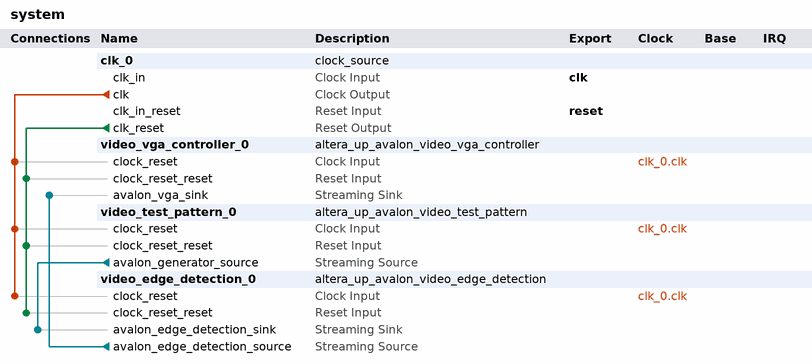
[diagram p0: system contents]
# Platform Designer (Qsys) system system, Cyclone II EP2C35F672C6
# Parameters at their usual value, and those the tool derives, are not listed.
package require -exact qsys 13.0
create_system system
set_project_property DEVICE_FAMILY {Cyclone II}
set_project_property DEVICE EP2C35F672C6

add_instance clk_0 clock_source 13.0
set_instance_parameter_value clk_0 clockFrequency 50000000

add_instance video_vga_controller_0 altera_up_avalon_video_vga_controller 13.0
set_instance_parameter_value video_vga_controller_0 board DE2

add_instance video_test_pattern_0 altera_up_avalon_video_test_pattern 13.0
set_instance_parameter_value video_test_pattern_0 width 720
set_instance_parameter_value video_test_pattern_0 height 720

add_instance video_edge_detection_0 altera_up_avalon_video_edge_detection 13.0
set_instance_parameter_value video_edge_detection_0 width 720
set_instance_parameter_value video_edge_detection_0 intensity 1

# connections
add_connection clk_0.clk video_edge_detection_0.clock_reset clock
add_connection clk_0.clk video_test_pattern_0.clock_reset clock
add_connection clk_0.clk video_vga_controller_0.clock_reset clock
add_connection clk_0.clk_reset video_edge_detection_0.clock_reset_reset reset
add_connection clk_0.clk_reset video_test_pattern_0.clock_reset_reset reset
add_connection clk_0.clk_reset video_vga_controller_0.clock_reset_reset reset
add_connection video_edge_detection_0.avalon_edge_detection_source video_vga_controller_0.avalon_vga_sink avalon_streaming
add_connection video_test_pattern_0.avalon_generator_source video_edge_detection_0.avalon_edge_detection_sink avalon_streaming

# exported interfaces
add_interface clk clock sink
set_interface_property clk EXPORT_OF clk_0.clk_in
add_interface reset reset sink
set_interface_property reset EXPORT_OF clk_0.clk_in_reset

set_interconnect_requirement {$system} qsys_mm.clockCrossingAdapter HANDSHAKE
set_interconnect_requirement {$system} qsys_mm.maxAdditionalLatency 1

save_system system.qsys
